# Altium schematic sheet Sheet1 - Copy.SchDoc
size A
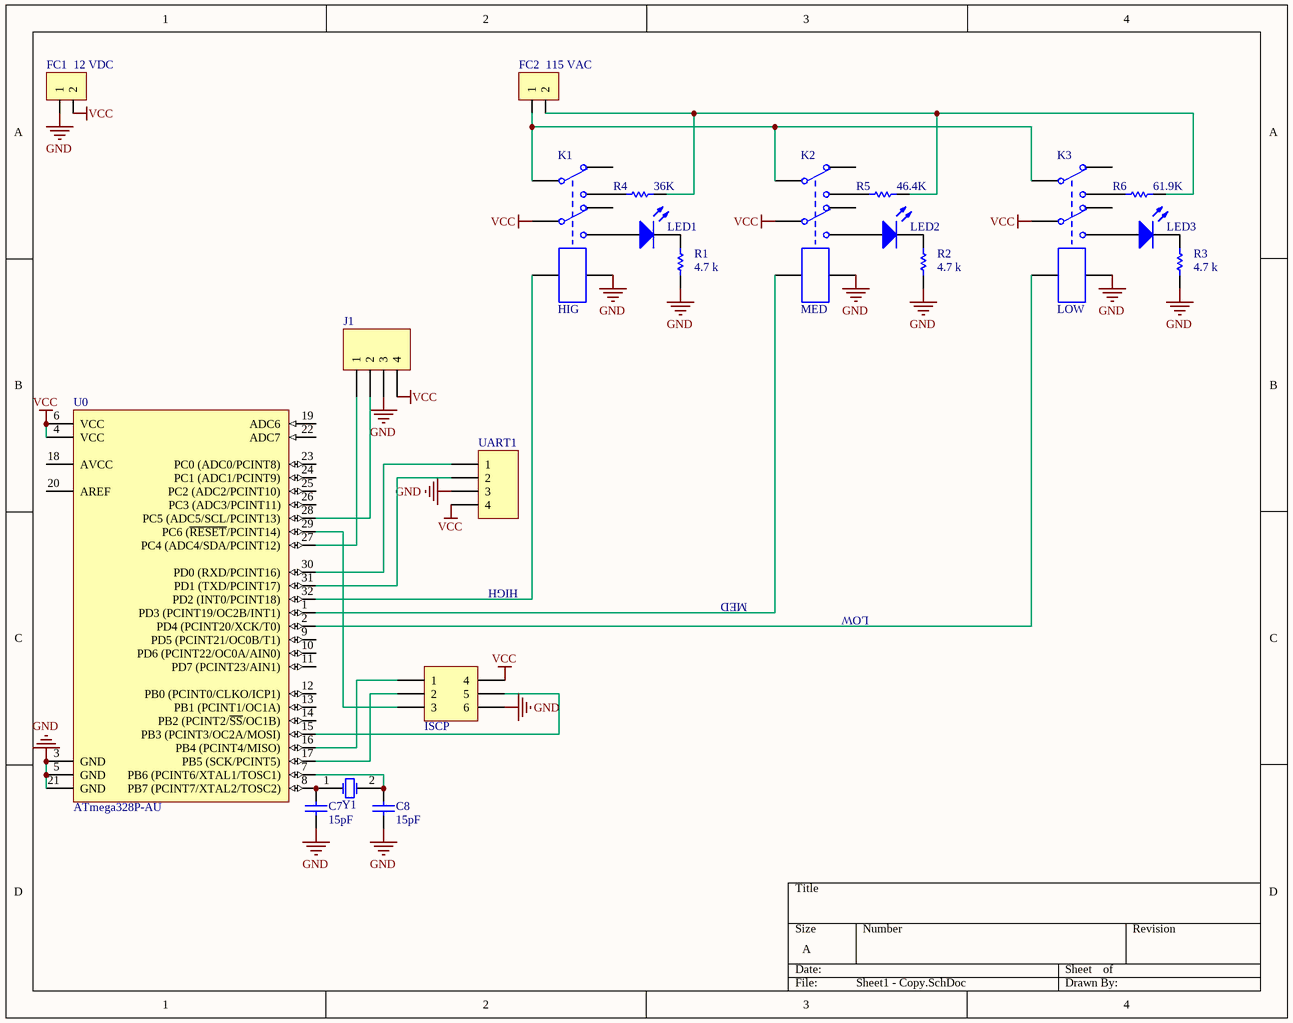
[diagram p0: Sheet1 - Copy.SchDoc]

## Parts
C7  value 15pF  [Cap1206_throu]  (hidden comment: Cap)
C8  value 15pF  [Cap1206_throu]  (hidden comment: Cap)
FC1  12 VDC  [CONNECTOR]
FC2  115 VAC  [CONNECTOR]
J1  Header 4  [HDR1X4]  (value not drawn)
K1  HIG  [RELAY]
K2  MED  [RELAY]
K3  LOW  [RELAY]
LED1  (no value)  [LED]
LED2  (no value)  [LED]
LED3  (no value)  [LED]
P11  ISCP  [HDR2X3_CEN]
R1  value 4.7 k  [Cap1206_throu]  (hidden comment: Res1)
R2  value 4.7 k  [Cap1206_throu]  (hidden comment: Res1)
R3  value 4.7 k  [Cap1206_throu]  (hidden comment: Res1)
R4  value 36K  [AXIAL-0.3]  (hidden comment: Res1)
R5  value 46.4K  [AXIAL-0.3]  (hidden comment: Res1)
R6  value 61.9K  [AXIAL-0.3]  (hidden comment: Res1)
U0  ATmega328P-AU  [32A_N]
UART1  Header 4  [HDR1X4]  (value not drawn)
Y1  XTAL  [CRYSTAL]  (value not drawn)

## Nets
GND: C7.1 C8.1 FC1.1 J1.3 K1.8 K2.8 K3.8 P11.6 R1.1 R2.1 R3.1 U0.3(GND) U0.5(GND) U0.21(GND) UART1.3
VCC: FC1.2 J1.4 K1.4 K2.4 K3.4 P11.4 U0.4(VCC) U0.6(VCC) UART1.4
NetC7_2: C7.2 U0.8(PB7_(PCINT7/XTAL2/TOSC2)) Y1.1(OSC1)
NetC8_2: C8.2 U0.7(PB6_(PCINT6/XTAL1/TOSC1)) Y1.2(OSC2)
NetFC2_1: FC2.1 K1.1 K2.1 K3.1
NetFC2_2: FC2.2 R4.2 R5.2 R6.2
NetJ1_1: J1.1 U0.27(PC4_(ADC4/SDA/PCINT12))
NetJ1_2: J1.2 U0.28(PC5_(ADC5/SCL/PCINT13))
NetK1_3: K1.3 R4.1
NetK1_6: K1.6 LED1.1(A)
NetK1_7: K1.7 U0.32(PD2_(INT0/PCINT18))
NetK2_3: K2.3 R5.1
NetK2_6: K2.6 LED2.1(A)
NetK2_7: K2.7 U0.1(PD3_(PCINT19/OC2B/INT1))
NetK3_3: K3.3 R6.1
NetK3_6: K3.6 LED3.1(A)
NetK3_7: K3.7 U0.2(PD4_(PCINT20/XCK/T0))
NetLED1_2: LED1.2(K) R1.2
NetLED2_2: LED2.2(K) R2.2
NetLED3_2: LED3.2(K) R3.2
NetP11_1: P11.1 U0.16(PB4_(PCINT4/MISO))
NetP11_2: P11.2 U0.17(PB5_(SCK/PCINT5))
NetP11_3: P11.3 U0.29(PC6_(~{RESET}/PCINT14))
NetP11_5: P11.5 U0.15(PB3_(PCINT3/OC2A/MOSI))
NetU0_30: U0.30(PD0_(RXD/PCINT16)) UART1.1
NetU0_31: U0.31(PD1_(TXD/PCINT17)) UART1.2

Not connected (* = marked no-connect by the designer): K1 2 5; K2 2 5; K3 2 5; U0 9(PD5_(PCINT21/OC0B/T1)) 10(PD6_(PCINT22/OC0A/AIN0)) 11(PD7_(PCINT23/AIN1)) 12(PB0_(PCINT0/CLKO/ICP1)) 13(PB1_(PCINT1/OC1A)) 14(PB2_(PCINT2/~{SS}/OC1B)) 18(AVCC) 19(ADC6) 20(AREF) 22(ADC7) 23(PC0_(ADC0/PCINT8)) 24(PC1_(ADC1/PCINT9)) 25(PC2_(ADC2/PCINT10)) 26(PC3_(ADC3/PCINT11))

## Notes on the sheet
- HIGH
- MED
- LOW

## Library data of the parts
C7 C8 = Cap: Capacitor; Published: 8-Jun-2000; LatestRevisionDate: 17-Jul-2002; LatestRevisionNote: Re-released for DXP Platform.; PackageReference: RAD-0.3; Publisher: Altium Limited; PackageDescription: Radial Cap, Thru-Hole; 2 Leads; 0.3 in Pin Spacing
FC1 FC2 = CONNECTOR
J1 UART1 = Header 4: Header, 4-Pin; LatestRevisionDate: 17-Jul-2002; LatestRevisionNote: Re-released for DXP Platform.; Publisher: Altium Limited
K1-K3 = Relay-DPDT: Dual-Pole Dual-Throw Relay; Published: 24-Mar-1999; LatestRevisionDate: 17-Jul-2002; LatestRevisionNote: Re-released for DXP Platform.; PackageReference: DIP-P8; Publisher: Altium Limited; PackageDescription: Relay; 8 Leads
LED1-LED3 = LED0: Typical INFRARED GaAs LED; Published: 8-Jun-2000; LatestRevisionDate: 08-Jul-2005; LatestRevisionNote: Mech Layer 1 removed.; PackageReference: LED-0; Publisher: Altium Limited; PackageDescription: LED; 2 Leads
P11 = Header 3X2A: Header, 3-Pin, Dual row; LatestRevisionDate: 17-Jul-2002; LatestRevisionNote: Re-released for DXP Platform.; Publisher: Altium Limited
R1-R6 = Res1: Resistor; Published: 8-Jun-2000; LatestRevisionDate: 17-Jul-2002; LatestRevisionNote: Re-released for DXP Platform.; PackageReference: AXIAL-0.3; Publisher: Altium Limited; PackageDescription: Axial Device, Thru-Hole; 2 Leads; 0.3 in Pin Spacing
U0 = ATmega328P-AU: 8-bit AVR Microcontroller, 32KB Flash, 1KB EEPROM, 2KB SRAM, 32-pin TQFP, Industrial Grade (-40°C to 85°C); Published: 1-Apr-2010; DatasheetVersion: revA, Jan-2010; PackageVersion: revB, Oct-2001; PackageReference: 32A; Publisher: Altium Limited; PackageDescription: 32-Lead, 7x7x1.0 mm Body, 0.8mm Lead Pitch, Thin Profile Plastic Quad Flat Package (TQFP); Supplier 1: Digi-Key; Supplier Part Number 1: ATMEGA328P-AU-ND; Supplier 2: Farnell; Supplier Part Number 2: 1715486; Supplier 3: Mouser; Supplier Part Number 3: 556-ATMEGA328P-AU; Code_JEDEC: MS-026-ABA; ComponentLink1Description: Manufacturer Link; ComponentLink1URL: http://www.atmel.com/products/avr/default.asp?; ComponentLink2Description: ATmega48A/48PA/88A/88PA/168A/168PA/328/328P Datasheet; ComponentLink2URL: http://www.atmel.com/dyn/resources/prod_documents/8271.pdf; ComponentLink3Description: ATmega48A/48PA/88A/88PA/168A/168PA/328/328P Summary; ComponentLink3URL: http://www.atmel.com/dyn/resources/prod_documents/8271S.pdf; ComponentLink4Description: Atmel.com Home; ComponentLink4URL: http://www.atmel.com
Y1 = XTAL: Crystal Oscillator; Published: 8-Jun-2000; LatestRevisionDate: 17-Jul-2002; LatestRevisionNote: Re-released for DXP Platform.; PackageReference: R38; Publisher: Altium Limited; PackageDescription: Crystal, Thru-Hole; 2 Leads; Body 3.1 x 8.2 mm (Dia.xH)